# EAGLE schematic MotorBoard (EAGLE 8.3.2)
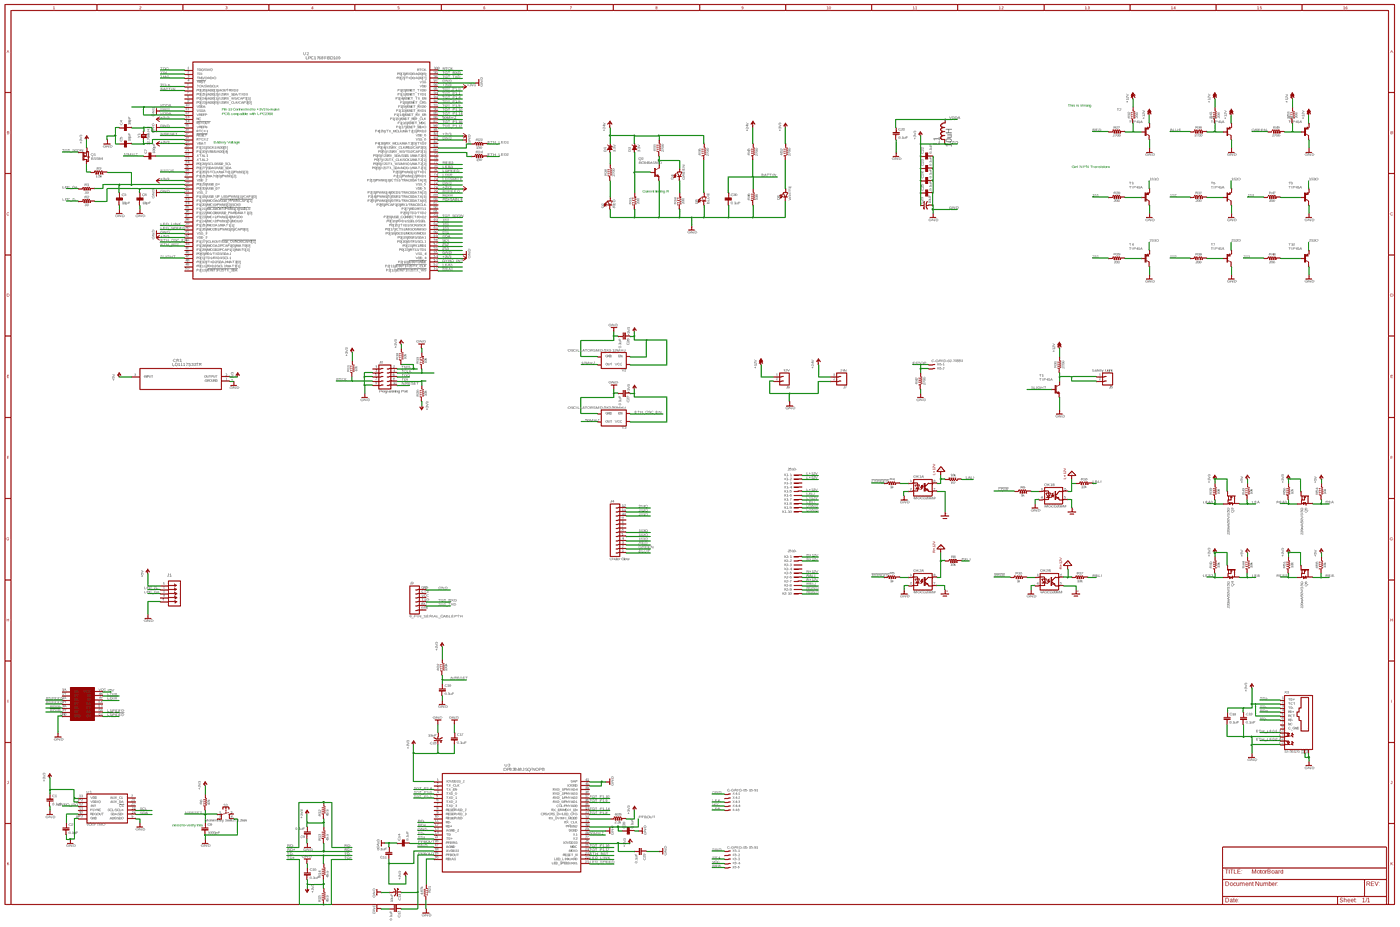
[diagram p0: schematic, sheet 1, overview]
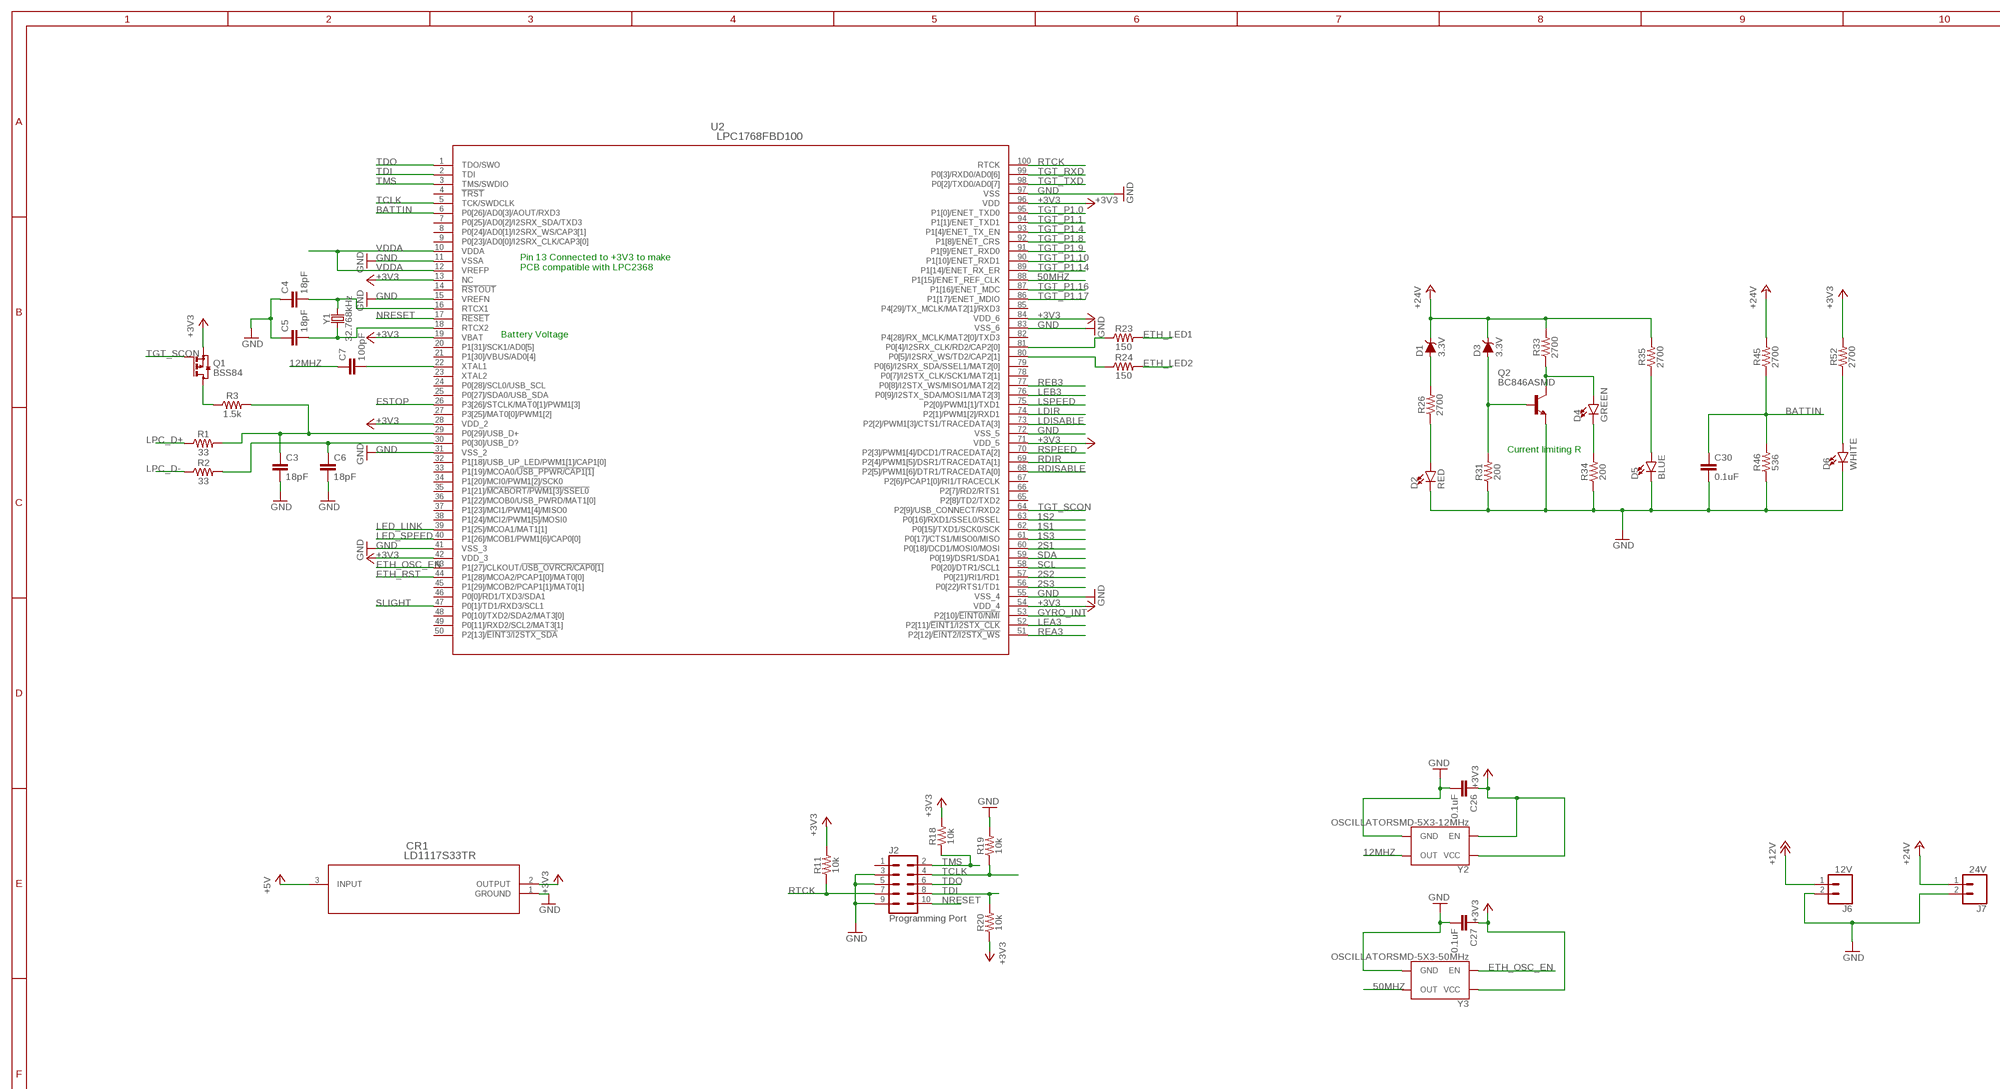
[diagram p1: schematic, sheet 1, part 1 of 4]
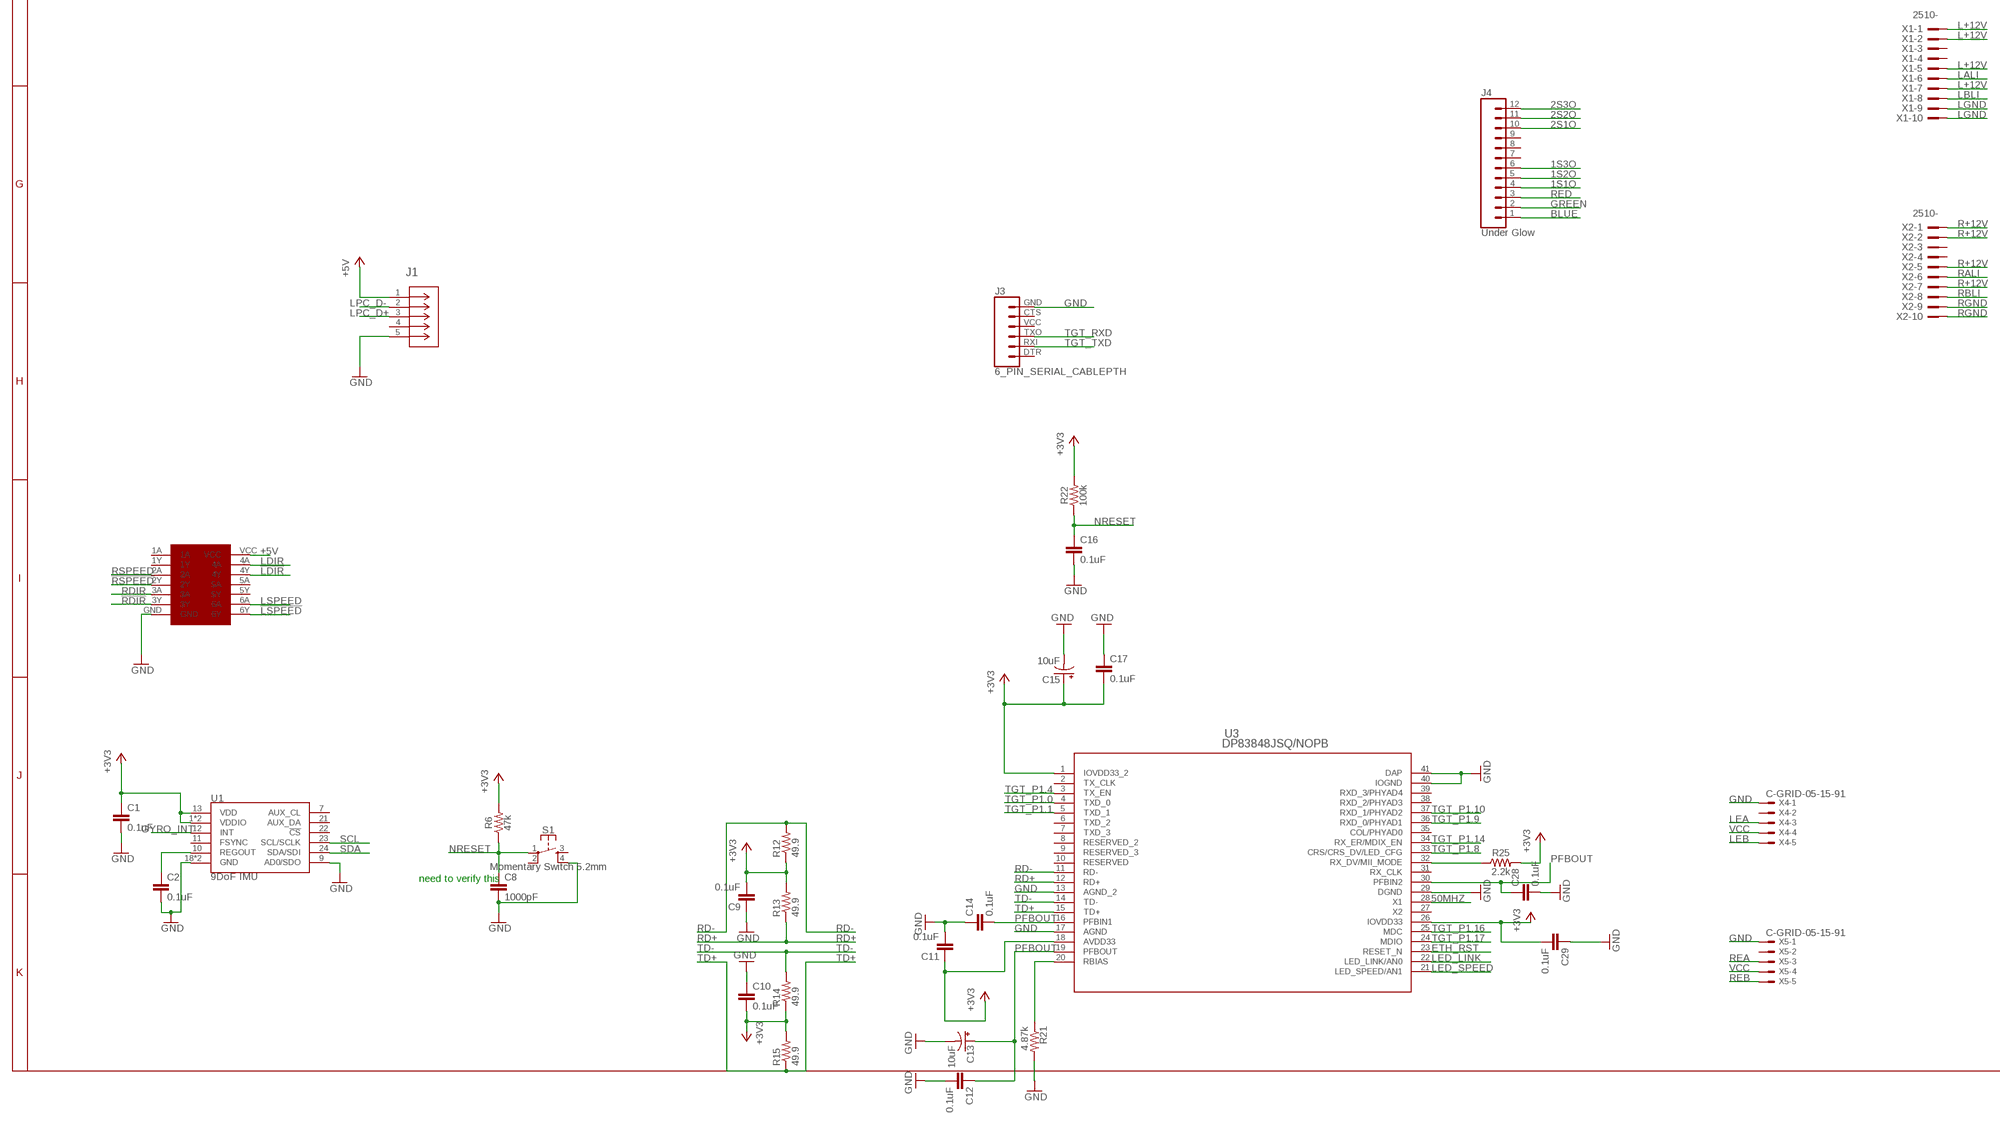
[diagram p2: schematic, sheet 1, part 2 of 4]
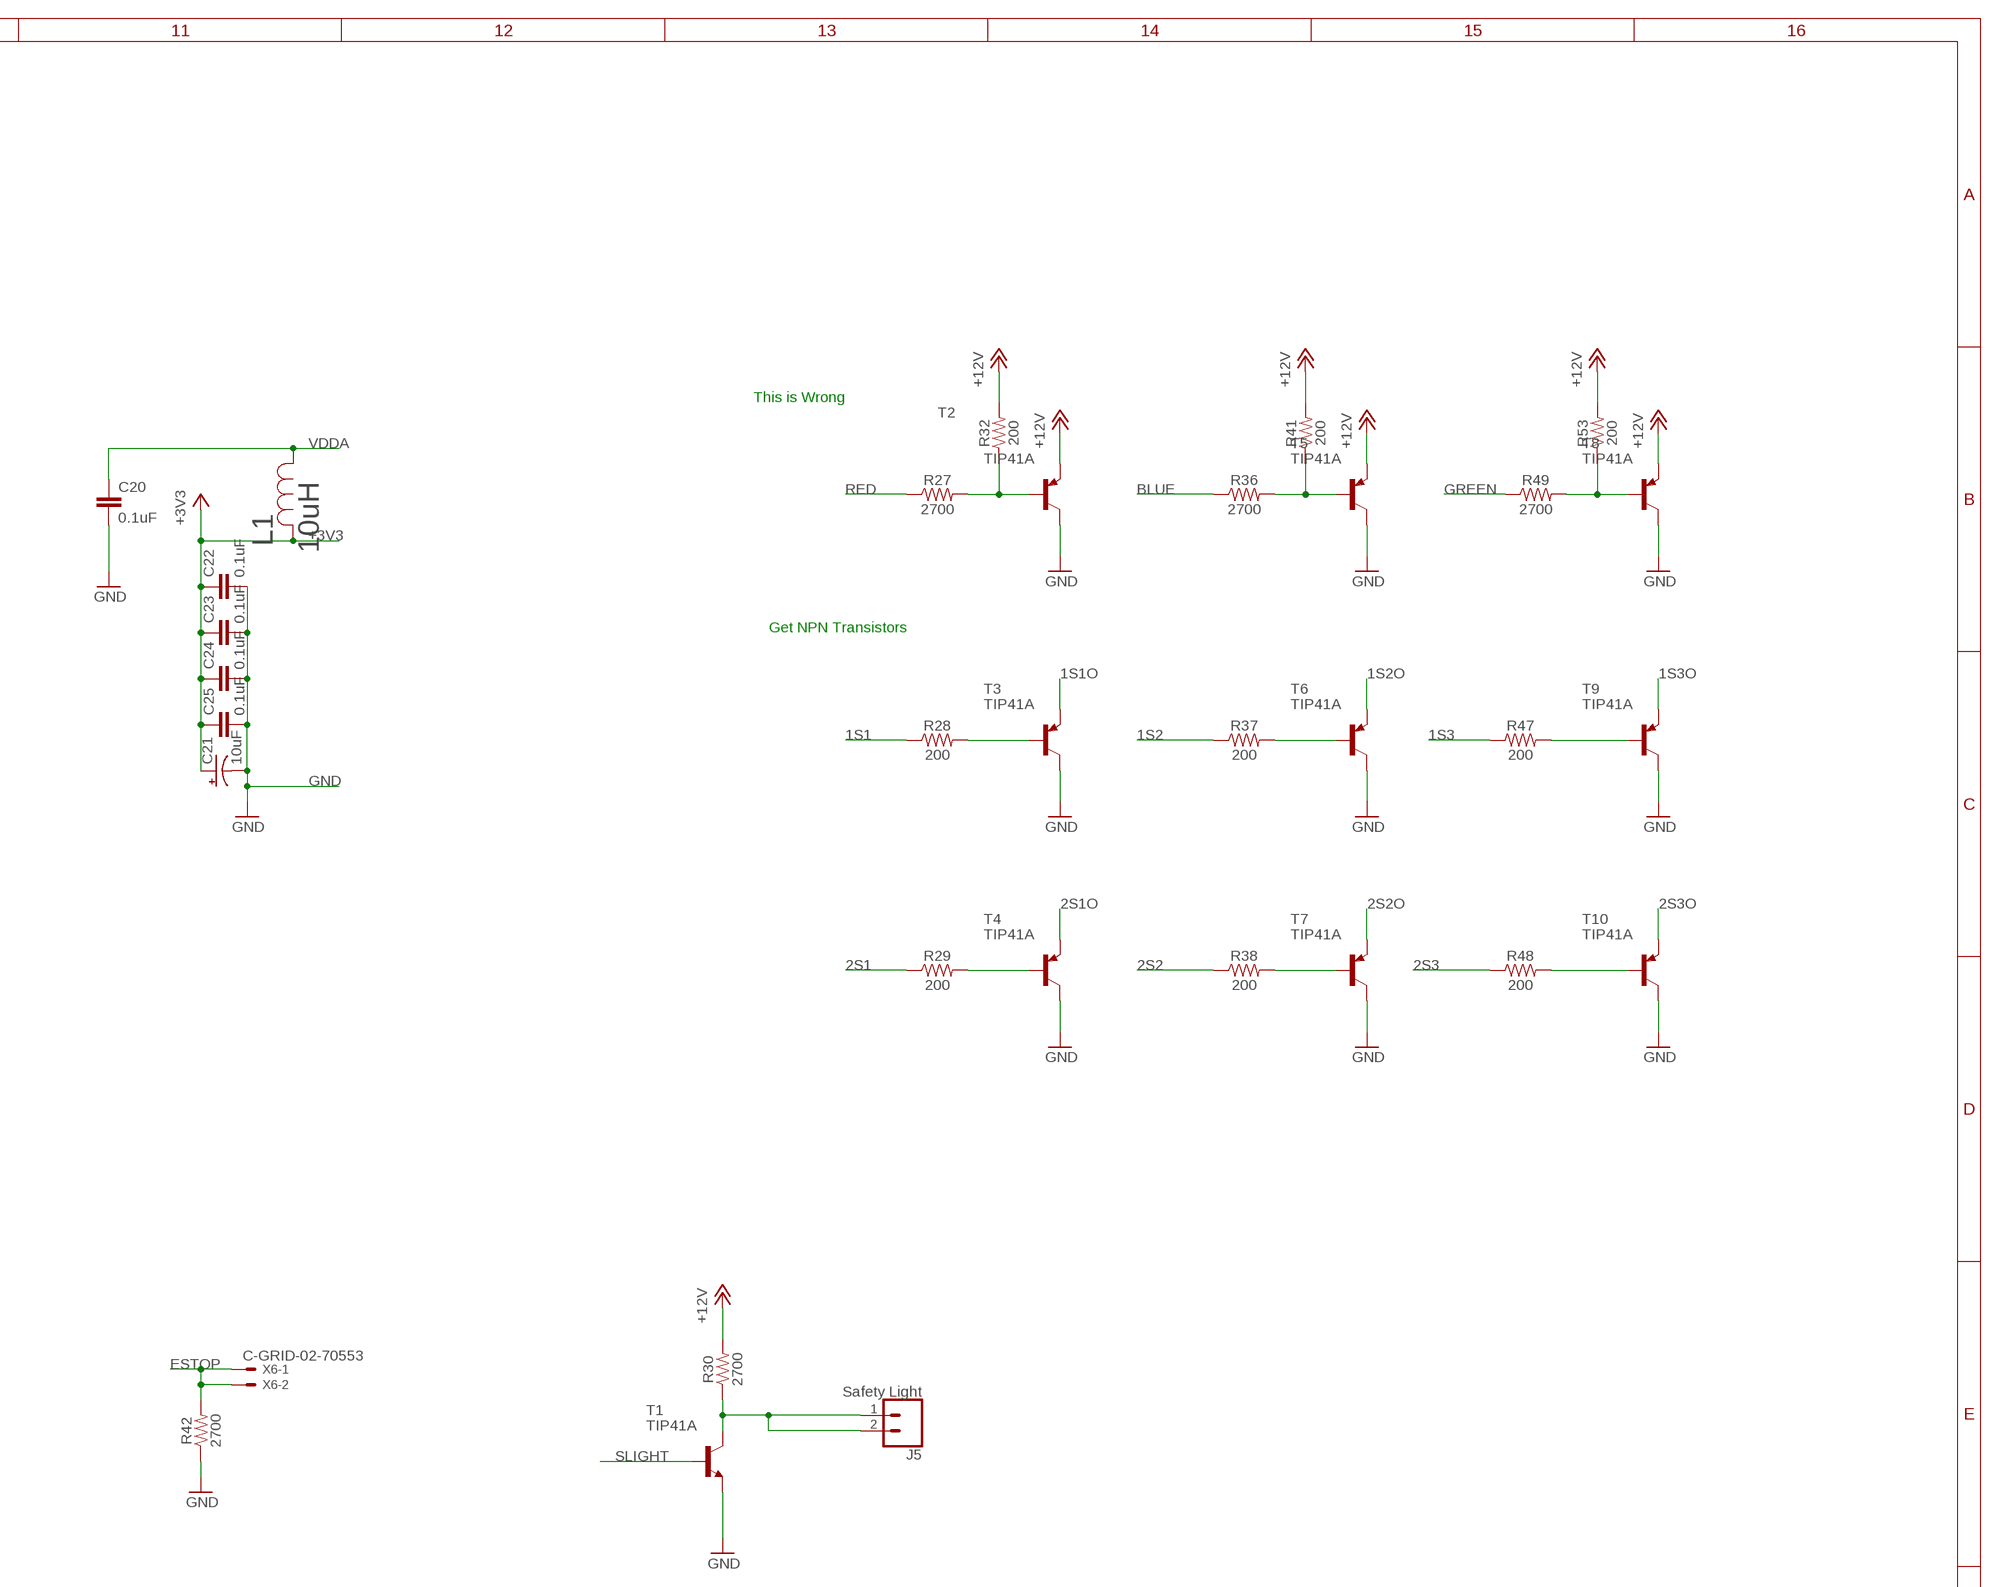
[diagram p3: schematic, sheet 1, part 3 of 4]
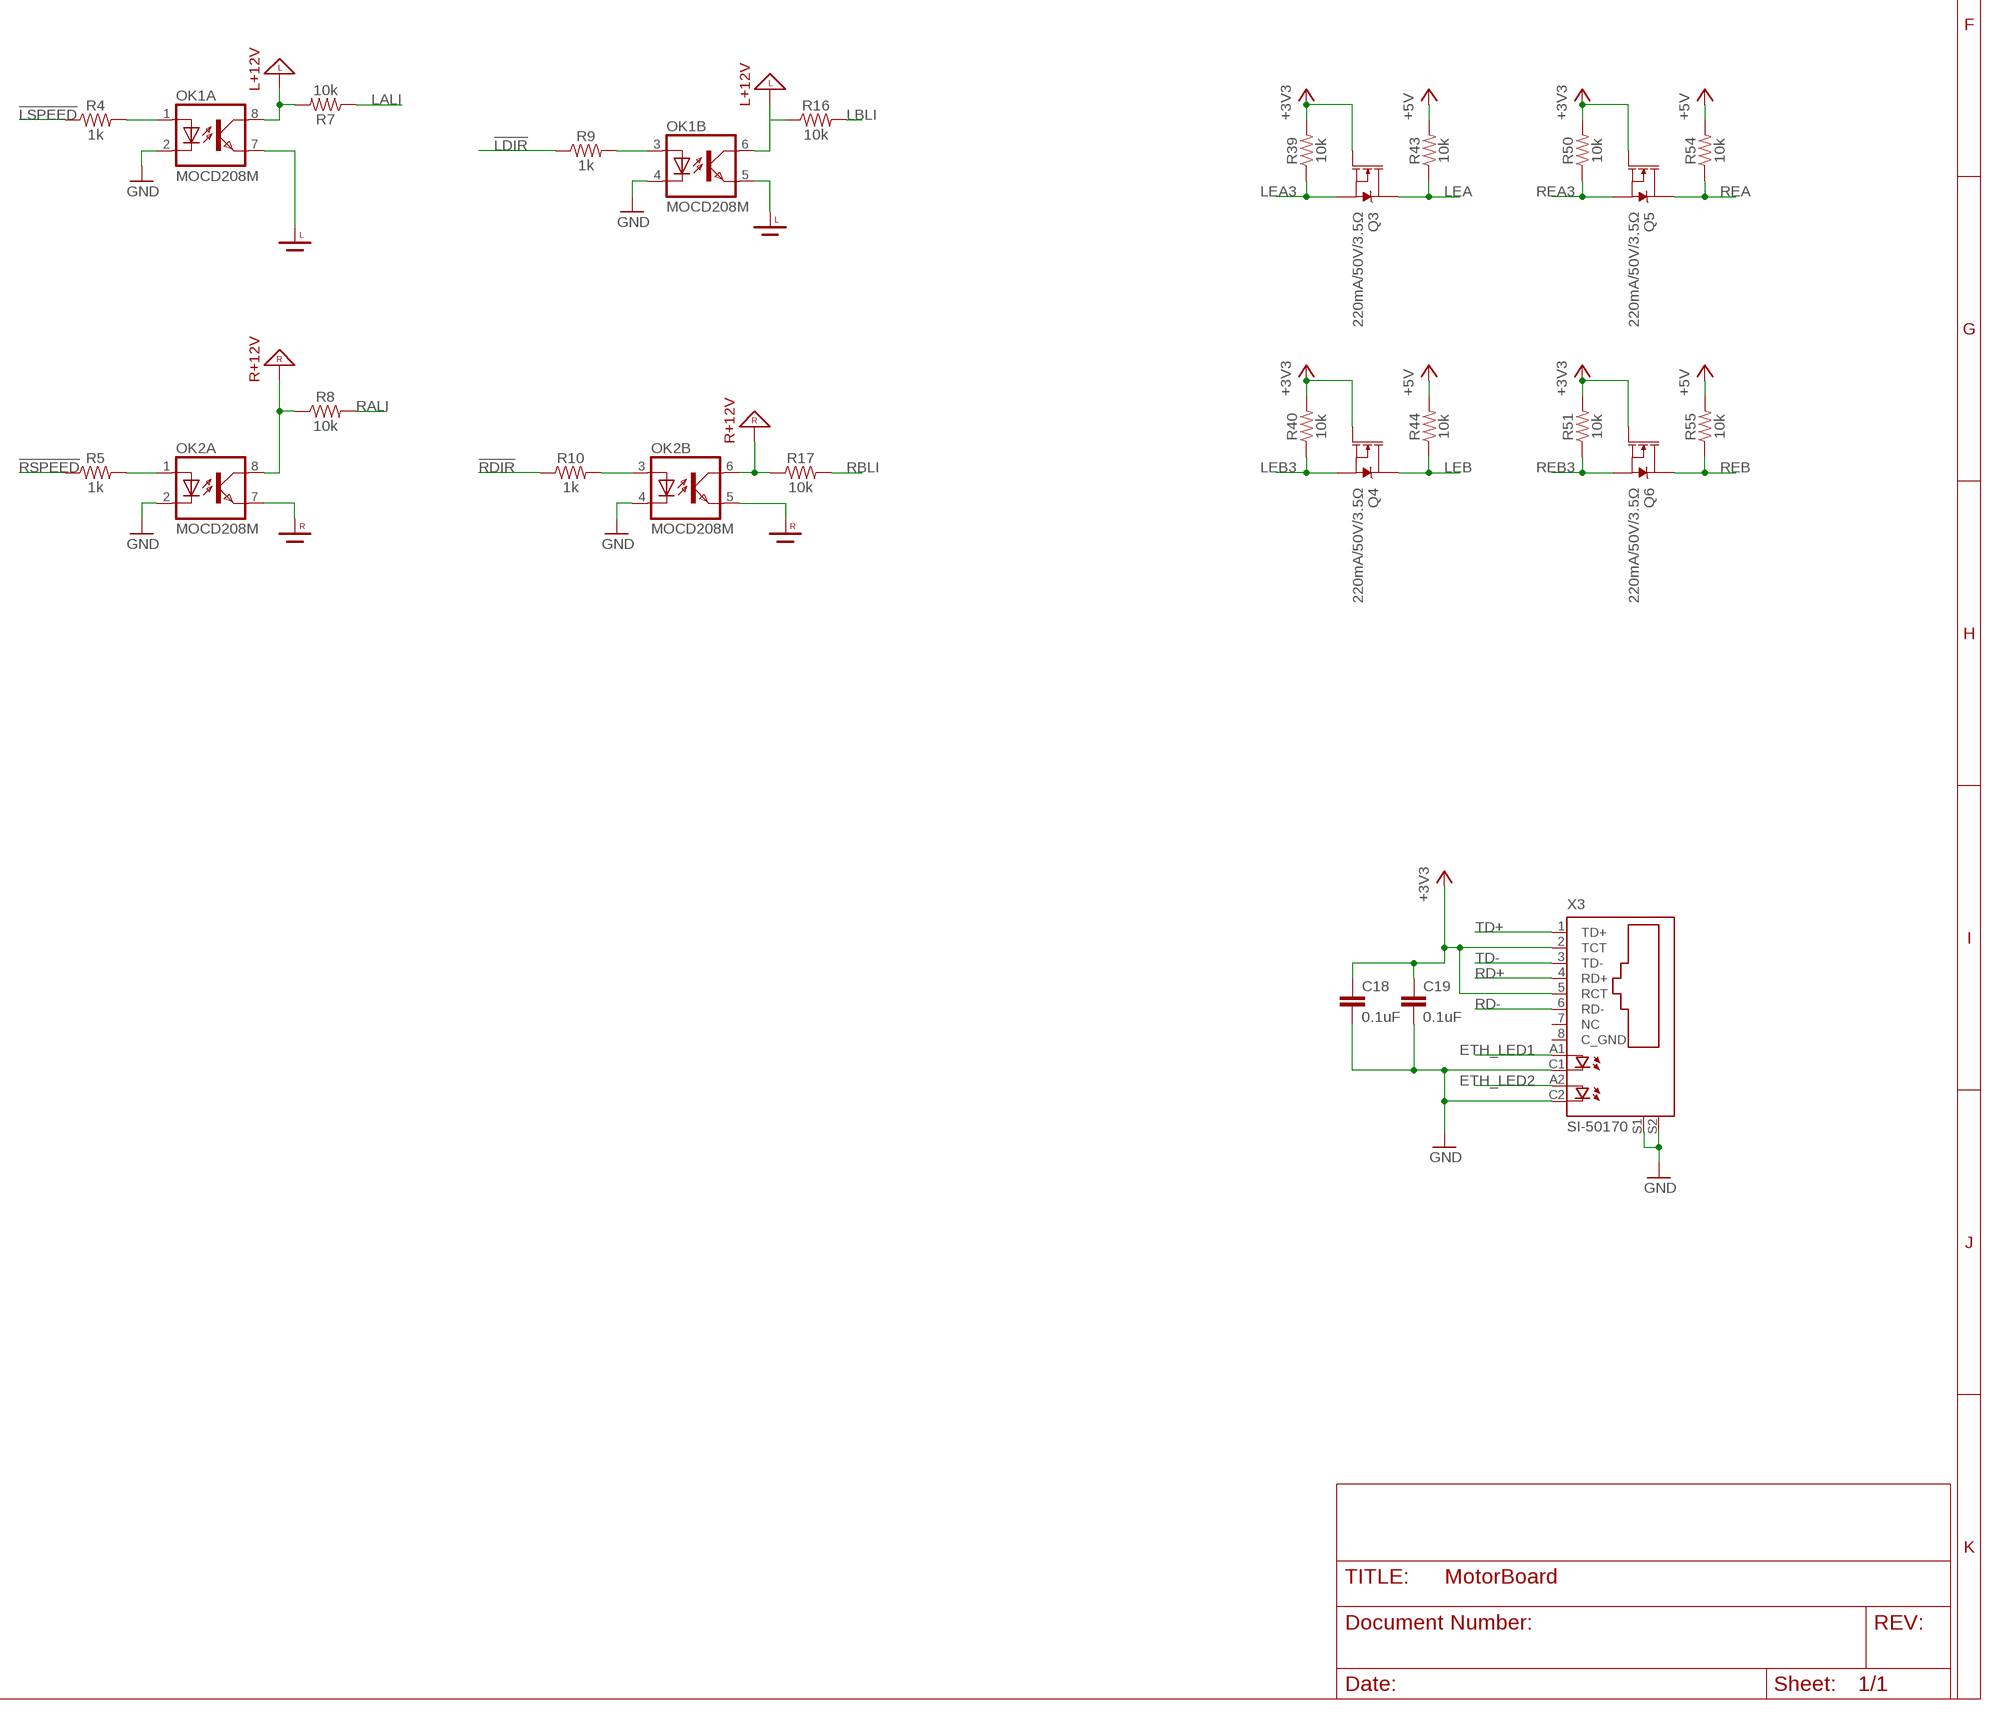
[diagram p4: schematic, sheet 1, part 4 of 4]

## Parts
C1  0.1uF  0.1UF-0603-25V-(+80/-20%)  [0603]
C2  0.1uF  0.1UF-0603-25V-(+80/-20%)  [0603]
C3  18pF  18PF-0603-50V-5%  [0603]
C4  18pF  18PF-0603-50V-5%  [0603]
C5  18pF  18PF-0603-50V-5%  [0603]
C6  18pF  18PF-0603-50V-5%  [0603]
C7  100pF  100PF-0603-50V-5%  [0603]
C8  1000pF  1.0NF/1000PF-0603-50V-10%  [0603]
C9  0.1uF  0.1UF-0603-25V-5%  [0603]
C10  0.1uF  0.1UF-0603-25V-5%  [0603]
C11  0.1uF  0.1UF-0603-25V-5%  [0603]
C12  0.1uF  0.1UF-0603-25V-5%  [0603]
C13  10uF  10UF-POLAR-0603-6.3V-20%(TANT)  [0603-POLAR]
C14  0.1uF  0.1UF-0603-25V-5%  [0603]
C15  10uF  10UF-POLAR-0603-6.3V-20%(TANT)  [0603-POLAR]
C16  0.1uF  0.1UF-0603-25V-(+80/-20%)  [0603]
C17  0.1uF  0.1UF-0603-25V-(+80/-20%)  [0603]
C18  0.1uF  0.1UF-0603-25V-(+80/-20%)  [0603]
C19  0.1uF  0.1UF-0603-25V-(+80/-20%)  [0603]
C20  0.1uF  0.1UF-0603-25V-(+80/-20%)  [0603]
C21  10uF  10UF-POLAR-0603-6.3V-20%(TANT)  [0603-POLAR]
C22  0.1uF  0.1UF-0603-25V-(+80/-20%)  [0603]
C23  0.1uF  0.1UF-0603-25V-(+80/-20%)  [0603]
C24  0.1uF  0.1UF-0603-25V-(+80/-20%)  [0603]
C25  0.1uF  0.1UF-0603-25V-(+80/-20%)  [0603]
C26  0.1uF  0.1UF-0603-25V-5%  [0603]
C27  0.1uF  0.1UF-0603-25V-5%  [0603]
C28  0.1uF  0.1UF-0603-25V-5%  [0603]
C29  0.1uF  0.1UF-0603-25V-5%  [0603]
C30  0.1uF  0.1UF-0603-25V-(+80/-20%)  [0603]
CR1  LD1117S33TR  [SOT-223]
D1  3.3V  DIODE-ZENER-MM3Z3V3T1G  [SOD-323]
D2  RED  LED0603  [LED-0603]
D3  3.3V  DIODE-ZENER-MM3Z3V3T1G  [SOD-323]
D4  GREEN  LED0603  [LED-0603]
D5  BLUE  LED0603  [LED-0603]
D6  WHITE  LED0603  [LED-0603]
J1  1981568-1  [CONN_1981568-1]
J2  Programming Port  CONN_05X2SHD  [2X5-SHROUDED]
J3  6_PIN_SERIAL_CABLEPTH  [FTDI_BASIC]
J4  Under Glow  CONN_12LOCK_LONGPADS  [1X12_LOCK_LONGPADS]
J5  Safety Light  CONN_02POLAR  [MOLEX-1X2]
J6  12V  CONN_025MM  [SCREWTERMINAL-5MM-2]
J7  24V  CONN_025MM  [SCREWTERMINAL-5MM-2]
L1  10uH  MLZ1608N100LT000  [IND_1608]
OK1  MOCD208M  [SOIC08-FAIRCHILD]
OK2  MOCD208M  [SOIC08-FAIRCHILD]
Q1  BSS84  [SOT23]
Q2  BC846ASMD  [SOT23]
Q3  220mA/50V/3.5Ω  MOSFET-NCH-BSS138  [SOT23-3]
Q4  220mA/50V/3.5Ω  MOSFET-NCH-BSS138  [SOT23-3]
Q5  220mA/50V/3.5Ω  MOSFET-NCH-BSS138  [SOT23-3]
Q6  220mA/50V/3.5Ω  MOSFET-NCH-BSS138  [SOT23-3]
R1  33  33OHM-0603-1/10W-1%  [0603]
R2  33  33OHM-0603-1/10W-1%  [0603]
R3  1.5k  1.5KOHM-0603-1/10W-1%  [0603]
R4  1k  1KOHM-0603-1/10W-1%  [0603]
R5  1k  1KOHM-0603-1/10W-1%  [0603]
R6  47k  47KOHM-0603-1/10W-1%  [0603]
R7  10k  10KOHM-0603-1/10W-1%  [0603]
R8  10k  10KOHM-0603-1/10W-1%  [0603]
R9  1k  1KOHM-0603-1/10W-1%  [0603]
R10  1k  1KOHM-0603-1/10W-1%  [0603]
R11  10k  10KOHM-0603-1/10W-1%  [0603]
R12  49.9  R-US_R0603  [R0603]
R13  49.9  R-US_R0603  [R0603]
R14  49.9  R-US_R0603  [R0603]
R15  49.9  R-US_R0603  [R0603]
R16  10k  10KOHM-0603-1/10W-1%  [0603]
R17  10k  10KOHM-0603-1/10W-1%  [0603]
R18  10k  10KOHM-0603-1/10W-1%  [0603]
R19  10k  10KOHM-0603-1/10W-1%  [0603]
R20  10k  10KOHM-0603-1/10W-1%  [0603]
R21  4.87k  R-US_R0603  [R0603]
R22  100k  100KOHM-0603-1/10W-1%  [0603]
R23  150  150OHM-0603-1/10W-1%  [0603]
R24  150  150OHM-0603-1/10W-1%  [0603]
R25  2.2k  2.2KOHM-0603-1/10W-1%  [0603]
R26  2700  3.9KOHM-0603-1/10W-1%  [0603]
R27  2700  2.55KOHM-0603-1/10W-1%  [0603]
R28  200  200OHM-0603-1/10W-1%  [0603]
R29  200  200OHM-0603-1/10W-1%  [0603]
R30  2700  3.9KOHM-0603-1/10W-1%  [0603]
R31  200  200OHM-0603-1/10W-1%  [0603]
R32  200  200OHM-0603-1/10W-1%  [0603]
R33  2700  3.9KOHM-0603-1/10W-1%  [0603]
R34  200  200OHM-0603-1/10W-1%  [0603]
R35  2700  3.9KOHM-0603-1/10W-1%  [0603]
R36  2700  2.55KOHM-0603-1/10W-1%  [0603]
R37  200  200OHM-0603-1/10W-1%  [0603]
R38  200  200OHM-0603-1/10W-1%  [0603]
R39  10k  10KOHM-0603-1/10W-1%  [0603]
R40  10k  10KOHM-0603-1/10W-1%  [0603]
R41  200  200OHM-0603-1/10W-1%  [0603]
R42  2700  3.9KOHM-0603-1/10W-1%  [0603]
R43  10k  10KOHM-0603-1/10W-1%  [0603]
R44  10k  10KOHM-0603-1/10W-1%  [0603]
R45  2700  3.9KOHM-0603-1/10W-1%  [0603]
R46  536  3.9KOHM-0603-1/10W-1%  [0603]
R47  200  200OHM-0603-1/10W-1%  [0603]
R48  200  200OHM-0603-1/10W-1%  [0603]
R49  2700  2.55KOHM-0603-1/10W-1%  [0603]
R50  10k  10KOHM-0603-1/10W-1%  [0603]
R51  10k  10KOHM-0603-1/10W-1%  [0603]
R52  2700  3.9KOHM-0603-1/10W-1%  [0603]
R53  200  200OHM-0603-1/10W-1%  [0603]
R54  10k  10KOHM-0603-1/10W-1%  [0603]
R55  10k  10KOHM-0603-1/10W-1%  [0603]
S1  Momentary Switch 5.2mm  MOMENTARY-SWITCH-SPST-2-SMD-5.2MM  [TACTILE_SWITCH_SMD_5.2MM]
T1  TIP41A  -NPN-TO220V  [TO220V]
T2  TIP41A  -PNP-TO220V  [TO220V]
T3  TIP41A  -PNP-TO220V  [TO220V]
T4  TIP41A  -PNP-TO220V  [TO220V]
T5  TIP41A  -PNP-TO220V  [TO220V]
T6  TIP41A  -PNP-TO220V  [TO220V]
T7  TIP41A  -PNP-TO220V  [TO220V]
T8  TIP41A  -PNP-TO220V  [TO220V]
T9  TIP41A  -PNP-TO220V  [TO220V]
T10  TIP41A  -PNP-TO220V  [TO220V]
U1  9DoF IMU  MPU-9250  [QFN24-3X3]
U2  LPC1768FBD100  [SOT407-1]
U3  DP83848JSQ/NOPB  [SQA40B]
U$14  ICHEXINV  [74HC14]
X1  2510-  [PAK100/2500-10]
X2  2510-  [PAK100/2500-10]
X3  SI-50170  [SI-50170]
X4  C-GRID-05-15-91  [15-91-05]
X5  C-GRID-05-15-91  [15-91-05]
X6  C-GRID-02-70553  [70553-02]
Y1  32.768kHz  CRYSTAL-32.768KHZSMD-3.2X1.5  [CRYSTAL-SMD-3.2X1.5MM]
Y2  OSCILLATORSMD-5X3-12MHz  OSCILLATORSMD-5X3  [OSCILLATOR-SMD-5X3.2]
Y3  OSCILLATORSMD-5X3-50MHz  OSCILLATORSMD-5X3  [OSCILLATOR-SMD-5X3.2]

## Nets
1S1: R28.1 U2.62(P0[15]/TXD1/SCK0/SCK)
1S1O: J4.4 T3.3(E)
1S2: R37.1 U2.63(P0[16]/RXD1/SSEL0/SSEL)
1S2O: J4.5 T6.3(E)
1S3: R47.1 U2.61(P0[17]/CTS1/MISO0/MISO)
1S3O: J4.6 T9.3(E)
2S1: R29.1 U2.60(P0[18]/DCD1/MOSI0/MOSI)
2S1O: J4.10 T4.3(E)
2S2: R38.1 U2.57(P0[21]/RI1/RD1)
2S2O: J4.11 T7.3(E)
2S3: R48.1 U2.56(P0[22]/RTS1/TD1)
2S3O: J4.12 T10.3(E)
12MHZ: C7.1 Y2.3(OUT)
50MHZ: U2.88(P1[15]/ENET_REF_CLK) U3.28(X1) Y3.3(OUT)
!LDIR!: R9.1 U$14.4Y
!LSPEED!: R4.1 U$14.6Y
!RDIR!: R10.1 U$14.3Y
!RSPEED!: R5.1 U$14.2Y
+3V3: C1.1 C9.2 C10.2 C11.1 C15.+ C17.2 C18.1 C19.1 C21.+ C22.1 C23.1 C24.1 C25.1 C26.1 C27.1 C29.2 CR1.2(OUTPUT) L1.2 Q1.2(S) Q3.1(G) Q4.1(G) Q5.1(G) Q6.1(G) R6.2 R11.2 R12.1 R13.2 R14.1 R15.2 R18.2 R20.1 R22.2 R25.2 R39.2 R40.2 R50.2 R51.2 R52.2 U1.1(VDDIO) U1.8(VDDIO) U1.13(VDD) U2.13(NC) U2.19(VBAT) U2.28(VDD_2) U2.42(VDD_3) U2.54(VDD_4) U2.71(VDD_5) U2.84(VDD_6) U2.96(VDD) U3.1(IOVDD33_2) U3.18(AVDD33) U3.26(IOVDD33) X3.2(TCT) X3.5(RCT) Y2.1(EN) Y2.4(VCC) Y3.4(VCC)
+5V: CR1.3(INPUT) J1.1 R43.2 R44.2 R54.2 R55.2 U$14.VCC
+12V: J6.1 R30.2 R32.2 R41.2 R53.2 T2.3(E) T5.3(E) T8.3(E)
+24V: D1.C D3.C J7.1 R33.2 R35.2 R45.2
BATTIN: C30.1 R45.1 R46.2 U2.6(P0[26]/AD0[3]/AOUT/RXD3)
BLUE: J4.1 R36.1
ESTOP: R42.2 U2.26(P3[26]/STCLK/MAT0[1]/PWM1[3]) X6.1 X6.2
ETH_LED1: R23.2 X3.A1(A)
ETH_LED2: R24.2 X3.A2(A1)
ETH_OSC_EN: U2.43(P1[27]/CLKOUT/!USB_OVRCR/CAP0[1]) Y3.1(EN)
ETH_RST: U2.44(P1[28]/MCOA2/PCAP1[0]/MAT0[0]) U3.23(RESET_N)
GND: C1.2 C2.2 C3.2 C4.1 C5.1 C6.2 C8.2 C9.1 C10.1 C11.2 C12.2 C13.- C14.1 C15.- C16.2 C17.1 C18.2 C19.2 C20.2 C21.- C22.2 C23.2 C24.2 C25.2 C26.2 C27.2 C28.2 C29.1 C30.2 CR1.1(GROUND) D2.C D5.C D6.C J1.5 J2.3 J2.5 J2.9 J3.GND J6.2 J7.2 OK1.2(A:C) OK1.4(B:C) OK2.2(A:C) OK2.4(B:C) Q2.2(E) R19.2 R21.2 R31.1 R34.1 R42.1 R46.1 S1.4 T1.3(E) T2.2(C) T3.2(C) T4.2(C) T5.2(C) T6.2(C) T7.2(C) T8.2(C) T9.2(C) T10.2(C) U1.9(AD0/SDO) U1.18(GND) U1.20(GND) U2.11(VSSA) U2.15(VREFN) U2.31(VSS_2) U2.41(VSS_3) U2.55(VSS_4) U2.72(VSS_5) U2.83(VSS_6) U2.97(VSS) U3.13(AGND_2) U3.17(AGND) U3.29(DGND) U3.40(IOGND) U3.41(DAP) U$14.GND X3.C1(C) X3.C2(C1) X3.S1 X3.S2 X4.1 X5.1 Y2.2(GND) Y3.2(GND)
GREEN: J4.2 R49.1
GYRO_INT: U1.12(INT) U2.53(P2[10]/!EINT0/NMI)
L+12V: OK1.6(B:COL) OK1.8(A:COL) R7.2 R16.1 X1.1 X1.2 X1.5 X1.7
LALI: R7.1 X1.6
LBLI: R16.2 X1.8
LDIR: U2.74(P2[1]/PWM1[2]/RXD1) U$14.4A
LDISABLE: U2.73(P2[2]/PWM1[3]/CTS1/TRACEDATA[3])
LEA: Q3.3(D) R43.1 X4.3
LEA3: Q3.2(S) R39.1 U2.52(P2[11]/!EINT1/I2STX_CLK)
LEB: Q4.3(D) R44.1 X4.5
LEB3: Q4.2(S) R40.1 U2.76(P0[9]/I2STX_SDA/MOSI1/MAT2[3])
LED_LINK: U2.39(P1[25]/MCOA1/MAT1[1]) U3.22(LED_LINK/AN0)
LED_SPEED: U2.40(P1[26]/MCOB1/PWM1[6]/CAP0[0]) U3.21(LED_SPEED/AN1)
LGND: OK1.5(B:EMIT) OK1.7(A:EMIT) X1.9 X1.10
LPC_D+: J1.3 R1.1
LPC_D-: J1.2 R2.1
LSPEED: U2.75(P2[0]/PWM1[1]/TXD1) U$14.6A
N$1: OK1.1(A:A) R4.2
N$2: C4.2 U2.16(RTCX1) Y1.P$2
N$3: C5.2 U2.18(RTCX2) Y1.P$1
N$4: Q1.3(D) R3.1
N$6: OK2.1(A:A) R5.2
N$7: OK2.3(B:A) R10.2
N$9: OK1.3(B:A) R9.2
N$10: C7.2 U2.22(XTAL1)
N$11: R23.1 U2.81(P0[4]/I2SRX_CLK/RD2/CAP2[0])
N$13: C2.1 U1.10(REGOUT)
N$14: R21.1 U3.20(RBIAS)
N$15: R24.1 U2.80(P0[5]/I2SRX_WS/TD2/CAP2[1])
N$16: R25.1 U3.32(RX_DV/MII_MODE)
N$24: J5.1 J5.2 R30.1 T1.2(C)
N$34: R27.2 R32.1 T2.1(B)
N$36: R36.2 R41.1 T5.1(B)
N$38: R49.2 R53.1 T8.1(B)
N$40: R47.2 T9.1(B)
N$41: R37.2 T6.1(B)
N$42: R28.2 T3.1(B)
N$43: R29.2 T4.1(B)
N$44: R38.2 T7.1(B)
N$45: R48.2 T10.1(B)
N$46: D1.A R26.2
N$47: D2.A R26.1
N$48: D4.C R34.2
N$49: D3.A Q2.1(B) R31.2
N$50: D5.A R35.1
N$51: D4.A Q2.3(C) R33.1
N$54: D6.A R52.1
NRESET: C8.1 C16.1 J2.10 R6.1 R22.1 S1.1 U2.17(!RESET)
PFBOUT: C12.1 C13.+ C14.2 C28.1 U3.16(PFBIN1) U3.19(PFBOUT) U3.30(PFBIN2)
R+12V: OK2.6(B:COL) OK2.8(A:COL) R8.1 R17.1 X2.1 X2.2 X2.5 X2.7
RALI: R8.2 X2.6
RBLI: R17.2 X2.8
RD+: R13.1 U3.12(RD+) X3.4(RD+)
RD-: R12.2 U3.11(RD-) X3.6(RD-)
RDIR: U2.69(P2[4]/PWM1[5]/DSR1/TRACEDATA[1]) U$14.3A
RDISABLE: U2.68(P2[5]/PWM1[6]/DTR1/TRACEDATA[0])
REA: Q5.3(D) R54.1 X5.3
REA3: Q5.2(S) R50.1 U2.51(P2[12]/!EINT2/I2STX_WS)
REB: Q6.3(D) R55.1 X5.5
REB3: Q6.2(S) R51.1 U2.77(P0[8]/I2STX_WS/MISO1/MAT2[2])
RED: J4.3 R27.1
RGND: OK2.5(B:EMIT) OK2.7(A:EMIT) X2.9 X2.10
RSPEED: U2.70(P2[3]/PWM1[4]/DCD1/TRACEDATA[2]) U$14.2A
RTCK: J2.7 R11.1 U2.100(RTCK)
SCL: U1.23(SCL/SCLK) U2.58(P0[20]/DTR1/SCL1)
SDA: U1.24(SDA/SDI) U2.59(P0[19]/DSR1/SDA1)
SLIGHT: T1.1(B) U2.47(P0[1]/TD1/RXD3/SCL1)
TCLK: J2.4 R19.1 U2.5(TCK/SWDCLK)
TD+: R15.1 U3.15(TD+) X3.1(TD+)
TD-: R14.2 U3.14(TD-) X3.3(TD-)
TDI: J2.8 R20.2 U2.2(TDI)
TDO: J2.6 U2.1(TDO/SWO)
TGT_P1.0: U2.95(P1[0]/ENET_TXD0) U3.4(TXD_0)
TGT_P1.1: U2.94(P1[1]/ENET_TXD1) U3.5(TXD_1)
TGT_P1.4: U2.93(P1[4]/ENET_TX_EN) U3.3(TX_EN)
TGT_P1.8: U2.92(P1[8]/ENET_CRS) U3.33(CRS/CRS_DV/LED_CFG)
TGT_P1.9: U2.91(P1[9]/ENET_RXD0) U3.36(RXD_0/PHYAD1)
TGT_P1.10: U2.90(P1[10]/ENET_RXD1) U3.37(RXD_1/PHYAD2)
TGT_P1.14: U2.89(P1[14]/ENET_RX_ER) U3.34(RX_ER/MDIX_EN)
TGT_P1.16: U2.87(P1[16]/ENET_MDC) U3.25(MDC)
TGT_P1.17: U2.86(P1[17]/ENET_MDIO) U3.24(MDIO)
TGT_RXD: J3.TXO U2.99(P0[3]/RXD0/AD0[6])
TGT_SCON: Q1.1(G) U2.64(P2[9]/USB_CONNECT/RXD2)
TGT_TXD: J3.RXI U2.98(P0[2]/TXD0/AD0[7])
TMS: J2.2 R18.1 U2.3(TMS/SWDIO)
USB_D+: C3.1 R1.2 R3.2 U2.29(P0[29]/USB_D+)
USB_D-: C6.1 R2.2 U2.30(P0[30]/USB_D?)
VCC: X4.4 X5.4
VDDA: C20.1 L1.1 U2.10(VDDA) U2.12(VREFP)
Unconnected: J1.4 J2.1 J3.CTS J3.DTR J3.VCC J4.7 J4.8 J4.9 S1.2 S1.3 U1.7(AUX_CL) U1.11(FSYNC) U1.21(AUX_DA) U1.22(!CS) U2.4(!TRST) U2.7(P0[25]/AD0[2]/I2SRX_SDA/TXD3) U2.8(P0[24]/AD0[1]/I2SRX_WS/CAP3[1]) U2.9(P0[23]/AD0[0]/I2SRX_CLK/CAP3[0]) U2.14(!RSTOUT) U2.20(P1[31]/SCK1/AD0[5]) U2.21(P1[30]/VBUS/AD0[4]) U2.23(XTAL2) U2.24(P0[28]/SCL0/USB_SCL) U2.25(P0[27]/SDA0/USB_SDA) U2.27(P3[25]/MAT0[0]/PWM1[2]) U2.32(P1[18]/USB_UP_LED/PWM1[1]/CAP1[0]) U2.33(P1[19]/MCOA0/!USB_PPWR/CAP1[1]) U2.34(P1[20]/MCI0/PWM1[2]/SCK0) U2.35(P1[21]/!MCABORT/PWM1[3]/SSEL0) U2.36(P1[22]/MCOB0/USB_PWRD/MAT1[0]) U2.37(P1[23]/MCI1/PWM1[4]/MISO0) U2.38(P1[24]/MCI2/PWM1[5]/MOSI0) U2.45(P1[29]/MCOB2/PCAP1[1]/MAT0[1]) U2.46(P0[0]/RD1/TXD3/SDA1) U2.48(P0[10]/TXD2/SDA2/MAT3[0]) U2.49(P0[11]/RXD2/SCL2/MAT3[1]) U2.50(P2[13]/!EINT3/I2STX_SDA) U2.65(P2[8]/TD2/TXD2) U2.66(P2[7]/RD2/RTS1) U2.67(P2[6]/PCAP1[0]/RI1/TRACECLK) U2.78(P0[7]/I2STX_CLK/SCK1/MAT2[1]) U2.79(P0[6]/I2SRX_SDA/SSEL1/MAT2[0]) U2.82(P4[28]/RX_MCLK/MAT2[0]/TXD3) U2.85(P4[29]/TX_MCLK/MAT2[1]/RXD3) U3.2(TX_CLK) U3.6(TXD_2) U3.7(TXD_3) U3.8(RESERVED_2) U3.9(RESERVED_3) U3.10(RESERVED) U3.27(X2) U3.31(RX_CLK) U3.35(COL/PHYAD0) U3.38(RXD_2/PHYAD3) U3.39(RXD_3/PHYAD4) U$14.1A U$14.1Y U$14.5A U$14.5Y X1.3 X1.4 X2.3 X2.4 X3.7(NC) X3.8(C_GND) X4.2 X5.2

## Notes on the sheet
- This is Wrong
- Pin 13 Connected to +3V3 to make 
  PCB compatible with LPC2368
- Battery Voltage
- Get NPN Transistors
- Current limiting R
- need to verify this

## Library data of the parts
C1 C2 C16-C20 C22-C25 C30 = SparkFun-Capacitors:0.1UF: 0.1µF ceramic capacitors A capacitor is a passive two-terminal electrical component used to store electrical energy temporarily in an electric field.; PROD_ID: CAP-00810
C3-C6 = SparkFun-Capacitors:18PF: 18pF ceramic capacitors A capacitor is a passive two-terminal electrical component used to store electrical energy temporarily in an electric field.; PROD_ID: CAP-08267
C7 = SparkFun-Capacitors:100PF: 100pF/0.1nF ceramic capacitors A capacitor is a passive two-terminal electrical component used to store electrical energy temporarily in an electric field.; PROD_ID: CAP-07883
C8 = SparkFun-Capacitors:1.0NF/1000PF: 1nF/1,000pF ceramic capacitors A capacitor is a passive two-terminal electrical component used to store electrical energy temporarily in an electric field.; PROD_ID: CAP-07886; VALUE: 1nF
C9-C12 C14 C26-C29 = SparkFun-Capacitors:0.1UF: 0.1µF ceramic capacitors A capacitor is a passive two-terminal electrical component used to store electrical energy temporarily in an electric field.; PROD_ID: CAP-08604
C13 C15 C21 = SparkFun-Capacitors:10UF-POLAR: 10.0µF polarized capacitors A capacitor is a passive two-terminal electrical component used to store electrical energy temporarily in an electric field.; PROD_ID: CAP-13210
CR1 = LD1117:LD1117S33TR; MANUFACTURER_PART_NUMBER: LD1117S33TR; VENDOR: ST Microelectronics
D1 D3 = SparkFun-DiscreteSemi:DIODE-ZENER: Zener Diode A Zener diode allows current to flow from its anode to its cathode like a normal semiconductor diode, but it also permits current to flow in the reverse direction when its "Zener voltage" is reached. - WIkipedia; PROD_ID: DIO-11284
D2 D4-D6 = SparkFun-LED:LED: LED (Generic) Standard schematic elements and footprints for 5mm, 3mm, 1206, and 0603 sized LEDs. Generic LEDs with no color specified.
J1 = DigiKey:1981568-1; MANUFACTURER_PART_NUMBER: 19815681; VENDOR: Tyco Electronics
J2 = SparkFun-Connectors:CONN_05X2: Multi connection point. Often used as Generic Header-pin footprint for 0.1 inch spaced/style header connections For AVR SPI programming port, see special device with nice symbol: "AVR_SPI_PROG_5x2.dev" You can populate with any combo of single row headers, but if you'd like an exact match, check these: 2x5 AVR ICSP Male Header (PRT-00778) 2x5 Pin Shrouded Header (PRT-08506) On any of the 0.1 inch spaced packages, you can populate with these: Break Away Headers - Straight (PRT-00116) Break Away Male Headers - Right Angle (PRT-00553) Female Headers (PRT-00115) Break Away Headers - Machine Pin (PRT-00117) Break Away Female Headers - Swiss Machine Pin (PRT-00743) Special note: the shrouded connector mates well with our 5x2 ribbon cables: 2x5 Pin IDC Ribbon Cable (PRT-08535); PROD_ID: CONN-08671; SF_ID: PRT-08506
J3 = SparkFun-Connectors:6_PIN_SERIAL_CABLE: 6-pin header connection for use with the "FTDI BASIC" pinout - CABLE SIDE. Also known as "Arduino Serial Program Header". This is used on a design to provide a 6-pin connection point for serial communication usually from a USB cable (D+/D-) to these headers (RX/TX). It also has the remaining pins necessary for programming in the Arduino evironment (DTR, GND, and sometimes VCC). Note, this device has "CABLE" in the name. It is intended to be used on a design that usually lives on the end of your USB cable and prvides the converter chip (FTDI232 or FTDI231x) to commnicate serial RX/TX. The "sister" device, named "TARGET" is inteneded to be used on a design that contains a target micro-controller that you wish to program. You can populate with some of these: Female Headers (PRT-00115) For reference (or to suit your programming needs) check out these designs: SparkFun FTDI Basic Breakout - 5V (DEV-09716) SparkFun FTDI Basic Breakout - 3.3V (DEV-09873) SparkFun FTDI SmartBasic (DEV-12935) SparkFun Beefy 3 - FTDI Basic Breakout (DEV-13746)
J4 = SparkFun-Connectors:CONN_12: Multi connection point. Often used as Generic Header-pin footprint for 0.1 inch spaced/style header connections On any of the 0.1 inch spaced packages, you can populate with these: Break Away Headers - Straight (PRT-00116) Break Away Male Headers - Right Angle (PRT-00553) Female Headers (PRT-00115) Break Away Headers - Machine Pin (PRT-00117) Break Away Female Headers - Swiss Machine Pin (PRT-00743) For SCREWTERMINALS and SPRING TERMINALS visit here: Screw Terimnals on SparkFun.com (5mm/3.5mm/2.54mm spacing) This device is also useful as a general connection point to wire up your design to another part of your project. Our various solder wires solder well into these plated through hole pads. Hook-Up Wire - Assortment (Stranded, 22 AWG) (PRT-11375) Hook-Up Wire - Assortment (Solid Core, 22 AWG) (PRT-11367) View the entire wire category on our website here Special notes: Molex polarized connector foot print use with SKU : PRT-08231 with associated crimp pins and housings. 1MM SMD Version SKU: PRT-10208 NOTES ON THE VARIANTS LOCK and LOCK_LONGPADS... This footprint was designed to help hold the alignment of a through-hole component (i.e. 6-pin header) while soldering it into place. You may notice that each hole has been shifted either up or down by 0.005 of an inch from it's more standard position (which is a perfectly straight line). This slight alteration caused the pins (the squares in the middle) to touch the edges of the holes. Because they are alternating, it causes a "brace" to hold the component in place. 0.005 has proven to be the perfect amount of "off-center" position when using our standard breakaway headers. Although looks a little odd when you look at the bare footprint, once you have a header in there, the alteration is very hard to notice. Also,if you push a header all the way into place, it is covered up entirely on the bottom side.
J5 = SparkFun-Retired:CONN_02: Multi connection point. Often used as Generic Header-pin footprint for 0.1 inch spaced/style header connections On any of the 0.1 inch spaced packages, you can populate with these: Break Away Headers - Straight (PRT-00116) Break Away Male Headers - Right Angle (PRT-00553) Female Headers (PRT-00115) Break Away Headers - Machine Pin (PRT-00117) Break Away Female Headers - Swiss Machine Pin (PRT-00743) For SCREWTERMINALS and SPRING TERMINALS visit here: Screw Terimnals on SparkFun.com (5mm/3.5mm/2.54mm spacing) This device is also useful as a general connection point to wire up your design to another part of your project. Our various solder wires solder well into these plated through hole pads. Hook-Up Wire - Assortment (Stranded, 22 AWG) (PRT-11375) Hook-Up Wire - Assortment (Solid Core, 22 AWG) (PRT-11367) View the entire wire category on our website here Special notes: Molex polarized connector foot print use with: PRT-08233 with associated crimp pins and housings. 2.54_SCREWTERM for use with PRT-10571. 3.5mm Screw Terminal footprints for PRT-08084 5mm Screw Terminal footprints for use with PRT-08432; SF_ID: PRT-09918
J6 J7 = SparkFun-Connectors:CONN_02: Multi connection point. Often used as Generic Header-pin footprint for 0.1 inch spaced/style header connections On any of the 0.1 inch spaced packages, you can populate with these: Break Away Headers - Straight (PRT-00116) Break Away Male Headers - Right Angle (PRT-00553) Female Headers (PRT-00115) Break Away Headers - Machine Pin (PRT-00117) Break Away Female Headers - Swiss Machine Pin (PRT-00743) For SCREWTERMINALS and SPRING TERMINALS visit here: Screw Terimnals on SparkFun.com (5mm/3.5mm/2.54mm spacing) This device is also useful as a general connection point to wire up your design to another part of your project. Our various solder wires solder well into these plated through hole pads. Hook-Up Wire - Assortment (Stranded, 22 AWG) (PRT-11375) Hook-Up Wire - Assortment (Solid Core, 22 AWG) (PRT-11367) View the entire wire category on our website here Special notes: Molex polarized connector foot print use with: PRT-08233 with associated crimp pins and housings. 2.54_SCREWTERM for use with PRT-10571. 3.5mm Screw Terminal footprints for PRT-08084 5mm Screw Terminal footprints for use with PRT-08432; SF_SKU: PRT-08432
L1 = DigiKey:MLZ1608N100LT000; MANUFACTURER_PART_NUMBER: MLZ1608N100LT000; VENDOR: TDK
OK1 OK2 = optocoupler:MOCD20*M: MOCD207M, MOCD208M Dual Channel Phototransistor Small Outline Surface Mount Optocouplers Source: Data sheet; MF: FAIRCHILD SEMICONDUCTOR; MPN: MOCD208M; OC_FARNELL: 1505465; OC_NEWARK: 34C7498
Q1 = transistor-small-signal:BSS84: P-CHANNEL MOS FET
Q2 = transistor-npn:BC846*: NPN Transistor
Q3-Q6 = SparkFun-DiscreteSemi:MOSFET-NCH: N-channel MOSFETs Voltage controlled devices that allow control of high current outputs. SparkFun Products: SparkFun OpenScale <https://www.sparkfun.com/products/13261> SparkFun Digital Sandbox <https://www.sparkfun.com/products/12651> SparkFun Monster Moto Shield <https://www.sparkfun.com/products/10182> SparkFun MOSFET Power Controller <https://www.sparkfun.com/products/11214>; PROD_ID: TRANS-00830
R1 R2 = SparkFun-Resistors:33OHM: 33Ω resistor A resistor is a passive two-terminal electrical component that implements electrical resistance as a circuit element. Resistors act to reduce current flow, and, at the same time, act to lower voltage levels within circuits. - Wikipedia; PROD_ID: RES-08270
R3 = SparkFun-Resistors:1.5KOHM: 1.5kΩ resistor A resistor is a passive two-terminal electrical component that implements electrical resistance as a circuit element. Resistors act to reduce current flow, and, at the same time, act to lower voltage levels within circuits. - Wikipedia; PROD_ID: RES-08306
R4 R5 R9 R10 = SparkFun-Resistors:1KOHM: 1kΩ resistor A resistor is a passive two-terminal electrical component that implements electrical resistance as a circuit element. Resistors act to reduce current flow, and, at the same time, act to lower voltage levels within circuits. - Wikipedia; PROD_ID: RES-07856
R6 = SparkFun-Resistors:47KOHM: 47kΩ resistor A resistor is a passive two-terminal electrical component that implements electrical resistance as a circuit element. Resistors act to reduce current flow, and, at the same time, act to lower voltage levels within circuits. - Wikipedia; PROD_ID: RES-07871
R7 R8 R11 R16-R20 R39 R40 R43 R44 R50 R51 R54 R55 = SparkFun-Resistors:10KOHM: 10kΩ resistor A resistor is a passive two-terminal electrical component that implements electrical resistance as a circuit element. Resistors act to reduce current flow, and, at the same time, act to lower voltage levels within circuits. - Wikipedia; PROD_ID: RES-00824
R12-R15 R21 = rcl:R-US_: RESISTOR, American symbol
R22 = SparkFun-Resistors:100KOHM: 100kΩ resistor A resistor is a passive two-terminal electrical component that implements electrical resistance as a circuit element. Resistors act to reduce current flow, and, at the same time, act to lower voltage levels within circuits. - Wikipedia; PROD_ID: RES-07828
R23 R24 = SparkFun-Resistors:150OHM: 150Ω resistor A resistor is a passive two-terminal electrical component that implements electrical resistance as a circuit element. Resistors act to reduce current flow, and, at the same time, act to lower voltage levels within circuits. - Wikipedia; PROD_ID: RES-11028
R25 = SparkFun-Resistors:2.2KOHM: 2.2kΩ resistor A resistor is a passive two-terminal electrical component that implements electrical resistance as a circuit element. Resistors act to reduce current flow, and, at the same time, act to lower voltage levels within circuits. - Wikipedia; PROD_ID: RES-08272
R26 R30 R33 R35 R42 R45 R46 R52 = SparkFun-Resistors:3.9KOHM: 3.9kΩ resistor A resistor is a passive two-terminal electrical component that implements electrical resistance as a circuit element. Resistors act to reduce current flow, and, at the same time, act to lower voltage levels within circuits. - Wikipedia; PROD_ID: RES-08701; VALUE: 3.9k
R27 R36 R49 = SparkFun-Resistors:2.55KOHM: 2.55kΩ resistor A resistor is a passive two-terminal electrical component that implements electrical resistance as a circuit element. Resistors act to reduce current flow, and, at the same time, act to lower voltage levels within circuits. - Wikipedia; PROD_ID: RES-11227; VALUE: 2.55k
R28 R29 R31 R32 R34 R37 R38 R41 R47 R48 R53 = SparkFun-Resistors:200OHM: 200Ω resistor A resistor is a passive two-terminal electrical component that implements electrical resistance as a circuit element. Resistors act to reduce current flow, and, at the same time, act to lower voltage levels within circuits. - Wikipedia; PROD_ID: RES-08220
S1 = SparkFun-Switches:MOMENTARY-SWITCH-SPST-2: Momentary Switch (Pushbutton) - SPST - Two Circuits Normally-open (NO) SPST momentary switches (buttons, pushbuttons). Schematic symbol includes two switch circuits. Variants SMD-4.6MMX2.8MM - 4.60mm x 2.80mm Tactile Momentary Button Switch - Used on SparkFun SAMD21 Mini Breakout SMD-5.2MM - Mini Pushbutton Switch - SMD - Used on Arduino Pro Mini; PROD_ID: SWCH-08247; SF_SKU: COM-08720
T1 = transistor:*-NPN-: NPN Transistror BF959 corrected 2008.03.06
T2-T10 = transistor:*-PNP-: PNP Transistror
U1 = SparkFun-Sensors:MPU-9250: MPU-9250 9 Degree of Freedom IMU System in Package that contains MPU-6500 & AK8963 NC pin 19. 2-6 & 14-17 not internally connected. May be used for PCB trace routing. Datasheet <https://cdn.sparkfun.com/assets/learn_tutorials/5/5/0/MPU9250REV1.0.pdf> SparkFun Products: SparkFun 9DoF Razor IMU M0 <https://www.sparkfun.com/products/14001> SparkFun IMU Breakout - MPU-9250 <https://www.sparkfun.com/products/13762>; PROD_ID: IC-13192
U2 = DigiKey:LPC1768FBD100; MANUFACTURER_PART_NUMBER: lpc1768fbd100; VENDOR: NXP
U3 = DigiKey:DP83848JSQ/NOPB; MANUFACTURER_PART_NUMBER: dp83848jsqnopb; VENDOR: National Semiconductor
U$14 = DigiKey:ICHEXINV
X1 X2 = con-3m:2510-: 3M (TM) Pak 100 4-Wall Header Source: 3M; MF: 3M; MPN: 2510-6002UB; OC_FARNELL: 9838244; OC_NEWARK: 46F4725
X3 = con-stewart:SI-50170: Ethernet Connector MagJack (R) Source: www.stewartconnector.com .. si-50170.pdf; OC_FARNELL: unknown; OC_NEWARK: unknown
X4 X5 = con-molex:C-GRID-05: CONNECTOR wire to board 2.54 mm (0.100") pitch header; OC_FARNELL: unknown; OC_NEWARK: unknown
X6 = con-molex:C-GRID-02: CONNECTOR wire to board 2.54 mm (0.100") pitch header; OC_FARNELL: unknown; OC_NEWARK: unknown
Y1 = SparkFun-Clocks:CRYSTAL-32.768KHZ: 32.768kHz Crystal Frequency: 32.768kHz Frequency Stability: ±20ppm Load Capacitance: 12.5pF (PTH-2X6 & SMD-3.2X1.5), 6pF (SMD-2X6) SparkFun Products: SparkFun BigTime Watch Kit <https://www.sparkfun.com/products/11734> SparkFun nRF52832 Breakout <https://www.sparkfun.com/products/13990> SparkFun Real Time Clock Module <https://www.sparkfun.com/products/12708>; PROD_ID: XTAL-13062
Y2 Y3 = SparkFun-Clocks:OSCILLATOR: Oscillators (Generic) These are active oscillators, which require a power source to generate their clock output. Most oscillators are configured to generate a set frequency (e.g. 16MHz). They have four pins: power, ground, output, and an enable input.